# Altium schematic sheet dcb_i2c_ext.SchDoc
size A; SheetNumber: 8; SheetTotal: 8
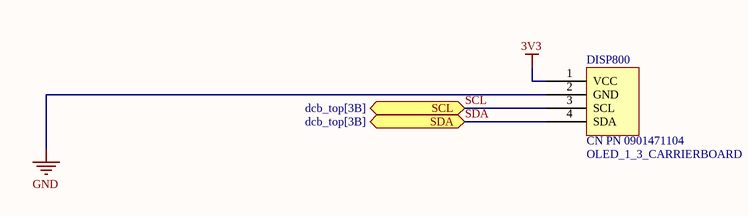
[diagram p0: dcb_i2c_ext.SchDoc]

## Parts
DISP800  OLED_1_3_CARRIERBOARD  [OLED_1_3_CARRIERBOARD-Footprint-1]

## Ports
SCL (bidir, see dcb_top[3B]), SDA (bidir, see dcb_top[3B])

## Nets
3V3: DISP800.1(VCC)
GND: DISP800.2(GND)
SCL: DISP800.3(SCL) ; port SCL
SDA: DISP800.4(SDA) ; port SDA

## Notes on the sheet
- (in symbol CMP-00028-00008-2) CN PN 0901471104

## Library data of the parts
DISP800 = CMP-00028-00008-2: Use 4 pin header 0901471104 on board